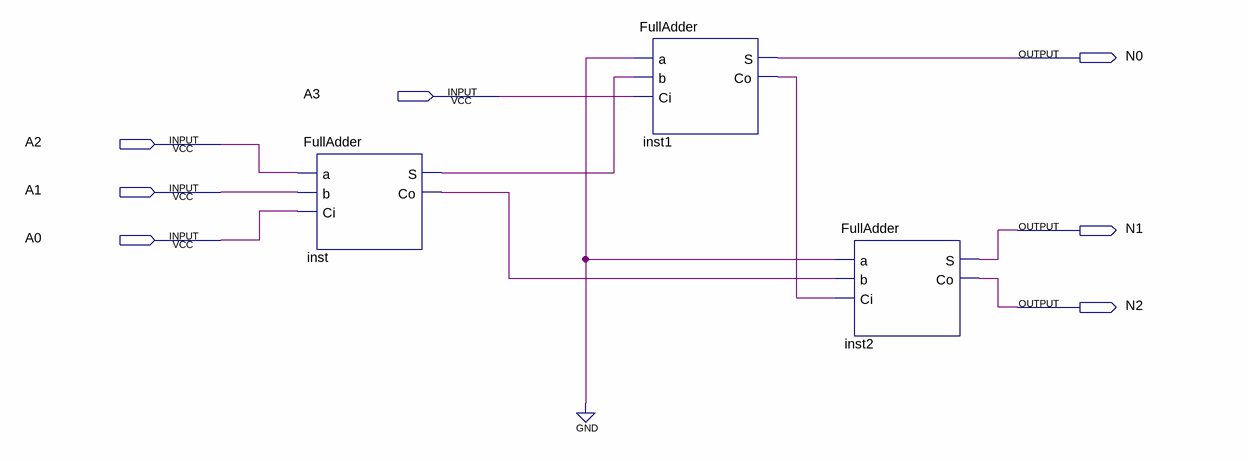
[diagram p0: schematic sheet]
// Quartus schematic Projeto1.bdf as structural Verilog: 3 symbols, 7 pins
module Projeto1 (
  input  A3,
  input  A2,
  input  A1,
  input  A0,
  output N0,
  output N1,
  output N2
);

  wire inst1_co, inst_co, inst_s;

  FullAdder inst (.a(A2), .b(A1), .Ci(A0), .S(inst_s), .Co(inst_co));
  FullAdder inst1 (.a(1'b0), .b(inst_s), .Ci(A3), .S(N0), .Co(inst1_co));
  FullAdder inst2 (.a(1'b0), .b(inst_co), .Ci(inst1_co), .S(N1), .Co(N2));
endmodule
